# Altium schematic sheet [09] - CPU - SD, AUDIO, I2C, CAN.SchDoc
size A2; DocumentNumber: 9; SheetNumber: 9; SheetTotal: 31
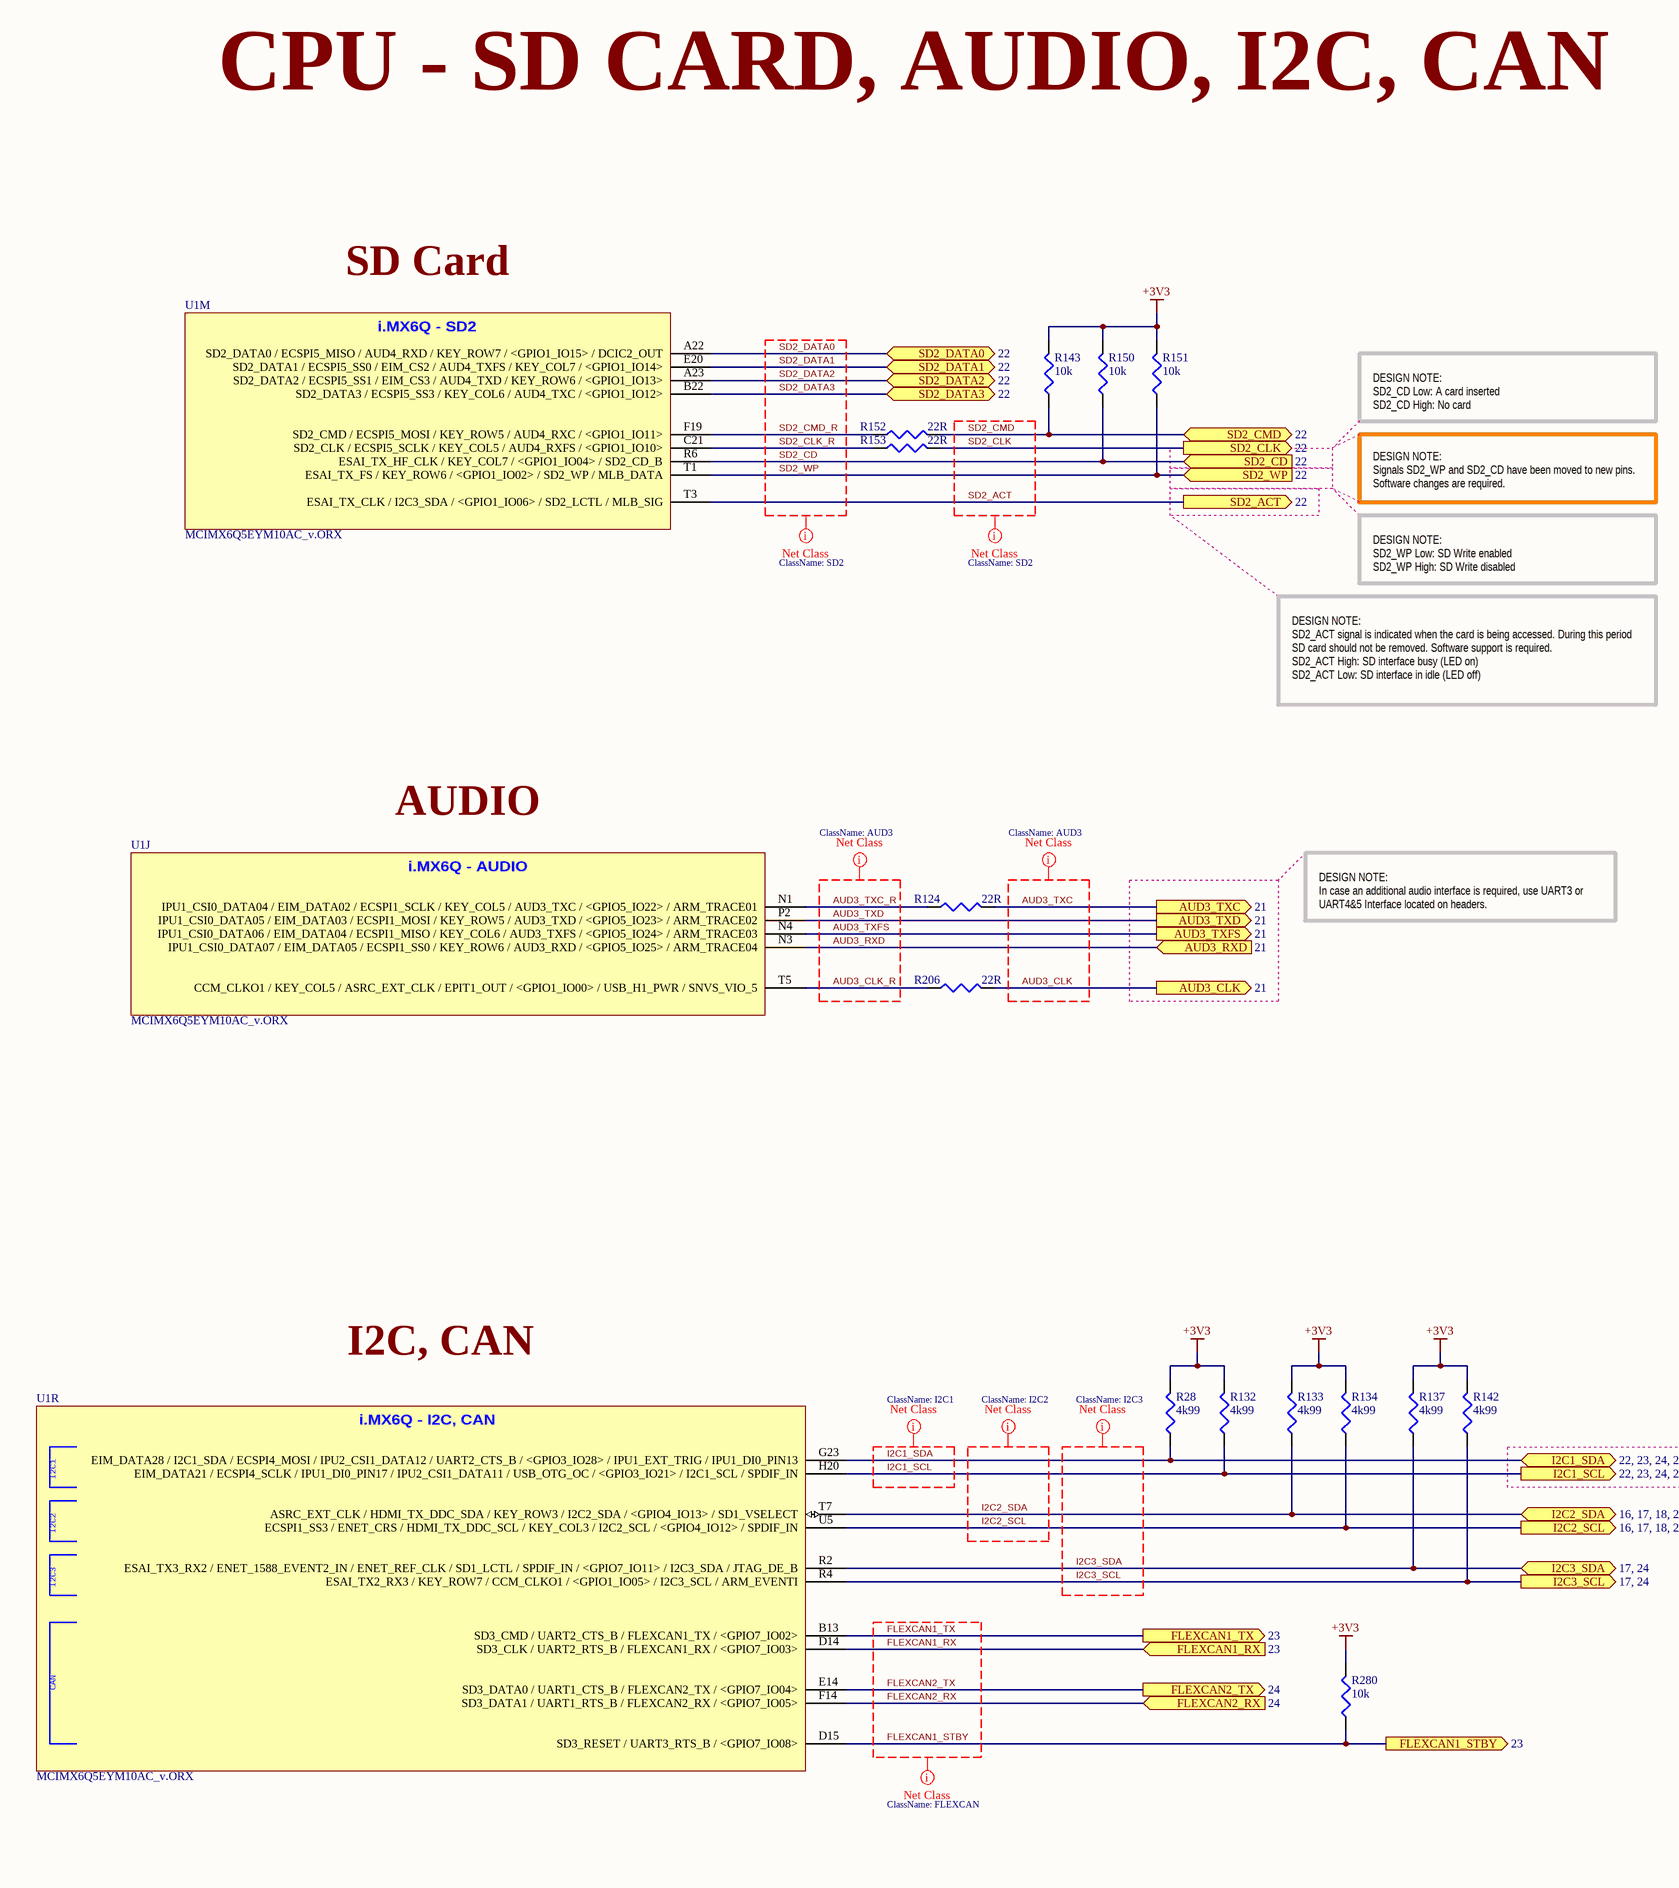
[diagram p0: [09] - CPU - SD, AUDIO, I2C, CAN.SchDoc, left]
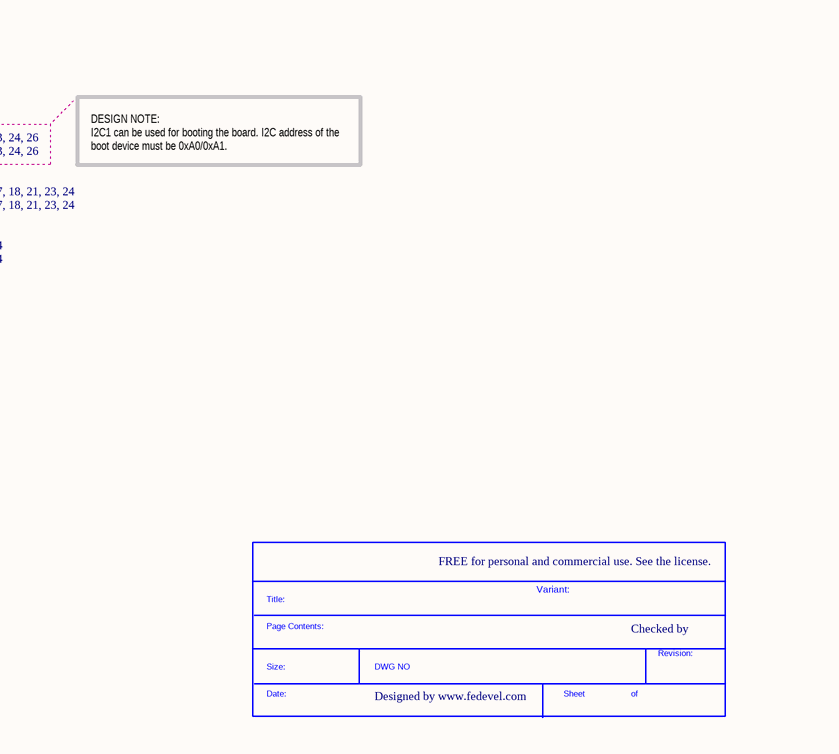
[diagram p1: [09] - CPU - SD, AUDIO, I2C, CAN.SchDoc, right]

## Parts
*  SDTitleBlock  (value not drawn)  (graphical)
R28  4k99  [R0402]
R124  22R  [R0402]
R132  4k99  [R0402]
R133  4k99  [R0402]
R134  4k99  [R0402]
R137  4k99  [R0402]
R142  4k99  [R0402]
R143  10k  [R0402]
R150  10k  [R0402]
R151  10k  [R0402]
R152  22R  [R0402]
R153  22R  [R0402]
R206  22R  [R0402]
R280  10k  [R0402]
U1  MCIMX6Q5EYM10AC_v.ORX  [PBGA624]  (parts J,M,R of 21)

## Ports
AUD3_CLK (out, see 21), AUD3_RXD (in, see 21), AUD3_TXC (out, see 21), AUD3_TXD (out, see 21), AUD3_TXFS (out, see 21), FLEXCAN1_RX (in, see 23), FLEXCAN1_STBY (out, see 23), FLEXCAN1_TX (out, see 23), FLEXCAN2_RX (in, see 24), FLEXCAN2_TX (out, see 24), I2C1_SCL (see 22, 23, 24, 26), I2C1_SDA (bidir, see 22, 23, 24, 26), I2C2_SCL (see 16, 17, 18, 21, 23, 24), I2C2_SDA (bidir, see 16, 17, 18, 21, 23, 24), I2C3_SCL (see 17, 24), I2C3_SDA (bidir, see 17, 24), SD2_ACT (out, see 22), SD2_CD (in, see 22), SD2_CLK (out, see 22), SD2_CMD (bidir, see 22), SD2_DATA0 (bidir, see 22), SD2_DATA1 (bidir, see 22), SD2_DATA2 (bidir, see 22), SD2_DATA3 (bidir, see 22), SD2_WP (in, see 22)

## Nets
+3V3: R28.2 R132.2 R133.2 R134.2 R137.2 R142.2 R143.2 R150.2 R151.2 R280.2
AUD3_CLK: R206.2 ; port AUD3_CLK
AUD3_CLK_R: R206.1 U1.T5(CCM_CLKO1_/_KEY_COL5_/_ASRC_EXT_CLK_/_EPIT1_OUT_/_<GPIO1_IO00>_/_USB_H1_PWR_/_SNVS_VIO_5)
AUD3_RXD: U1.N3(IPU1_CSI0_DATA07_/_EIM_DATA05_/_ECSPI1_SS0_/_KEY_ROW6_/_AUD3_RXD_/_<GPIO5_IO25>_/_ARM_TRACE04) ; port AUD3_RXD
AUD3_TXC: R124.2 ; port AUD3_TXC
AUD3_TXC_R: R124.1 U1.N1(IPU1_CSI0_DATA04_/_EIM_DATA02_/_ECSPI1_SCLK_/_KEY_COL5_/_AUD3_TXC_/_<GPIO5_IO22>_/_ARM_TRACE01)
AUD3_TXD: U1.P2(IPU1_CSI0_DATA05_/_EIM_DATA03_/_ECSPI1_MOSI_/_KEY_ROW5_/_AUD3_TXD_/_<GPIO5_IO23>_/_ARM_TRACE02) ; port AUD3_TXD
AUD3_TXFS: U1.N4(IPU1_CSI0_DATA06_/_EIM_DATA04_/_ECSPI1_MISO_/_KEY_COL6_/_AUD3_TXFS_/_<GPIO5_IO24>_/_ARM_TRACE03) ; port AUD3_TXFS
FLEXCAN1_RX: U1.D14(SD3_CLK_/_UART2_RTS_B_/_FLEXCAN1_RX_/_<GPIO7_IO03>) ; port FLEXCAN1_RX
FLEXCAN1_STBY: R280.1 U1.D15(SD3_RESET_/_UART3_RTS_B_/_<GPIO7_IO08>) ; port FLEXCAN1_STBY
FLEXCAN1_TX: U1.B13(SD3_CMD_/_UART2_CTS_B_/_FLEXCAN1_TX_/_<GPIO7_IO02>) ; port FLEXCAN1_TX
FLEXCAN2_RX: U1.F14(SD3_DATA1_/_UART1_RTS_B_/_FLEXCAN2_RX_/_<GPIO7_IO05>) ; port FLEXCAN2_RX
FLEXCAN2_TX: U1.E14(SD3_DATA0_/_UART1_CTS_B_/_FLEXCAN2_TX_/_<GPIO7_IO04>) ; port FLEXCAN2_TX
I2C1_SCL: R132.1 U1.H20(EIM_DATA21_/_ECSPI4_SCLK_/_IPU1_DI0_PIN17_/_IPU2_CSI1_DATA11_/_USB_OTG_OC_/_<GPIO3_IO21>_/_I2C1_SCL_/_SPDIF_IN) ; port I2C1_SCL
I2C1_SDA: R28.1 U1.G23(EIM_DATA28_/_I2C1_SDA_/_ECSPI4_MOSI_/_IPU2_CSI1_DATA12_/_UART2_CTS_B_/_<GPIO3_IO28>_/_IPU1_EXT_TRIG_/_IPU1_DI0_PIN13) ; port I2C1_SDA
I2C2_SCL: R134.1 U1.U5(ECSPI1_SS3_/_ENET_CRS_/_HDMI_TX_DDC_SCL_/_KEY_COL3_/_I2C2_SCL_/_<GPIO4_IO12>_/_SPDIF_IN) ; port I2C2_SCL
I2C2_SDA: R133.1 U1.T7(ASRC_EXT_CLK_/_HDMI_TX_DDC_SDA_/_KEY_ROW3_/_I2C2_SDA_/_<GPIO4_IO13>_/_SD1_VSELECT) ; port I2C2_SDA
I2C3_SCL: R142.1 U1.R4(ESAI_TX2_RX3_/_KEY_ROW7_/_CCM_CLKO1_/_<GPIO1_IO05>_/_I2C3_SCL_/_ARM_EVENTI) ; port I2C3_SCL
I2C3_SDA: R137.1 U1.R2(ESAI_TX3_RX2_/_ENET_1588_EVENT2_IN_/_ENET_REF_CLK_/_SD1_LCTL_/_SPDIF_IN_/_<GPIO7_IO11>_/_I2C3_SDA_/_JTAG_DE_B) ; port I2C3_SDA
SD2_ACT: U1.T3(ESAI_TX_CLK_/_I2C3_SDA_/_<GPIO1_IO06>_/_SD2_LCTL_/_MLB_SIG) ; port SD2_ACT
SD2_CD: R150.1 U1.R6(ESAI_TX_HF_CLK_/_KEY_COL7_/_<GPIO1_IO04>_/_SD2_CD_B) ; port SD2_CD
SD2_CLK: R153.2 ; port SD2_CLK
SD2_CLK_R: R153.1 U1.C21(SD2_CLK_/_ECSPI5_SCLK_/_KEY_COL5_/_AUD4_RXFS_/_<GPIO1_IO10>)
SD2_CMD: R143.1 R152.2 ; port SD2_CMD
SD2_CMD_R: R152.1 U1.F19(SD2_CMD_/_ECSPI5_MOSI_/_KEY_ROW5_/_AUD4_RXC_/_<GPIO1_IO11>)
SD2_DATA0: U1.A22(SD2_DATA0_/_ECSPI5_MISO_/_AUD4_RXD_/_KEY_ROW7_/_<GPIO1_IO15>_/_DCIC2_OUT) ; port SD2_DATA0
SD2_DATA1: U1.E20(SD2_DATA1_/_ECSPI5_SS0_/_EIM_CS2_/_AUD4_TXFS_/_KEY_COL7_/_<GPIO1_IO14>) ; port SD2_DATA1
SD2_DATA2: U1.A23(SD2_DATA2_/_ECSPI5_SS1_/_EIM_CS3_/_AUD4_TXD_/_KEY_ROW6_/_<GPIO1_IO13>) ; port SD2_DATA2
SD2_DATA3: U1.B22(SD2_DATA3_/_ECSPI5_SS3_/_KEY_COL6_/_AUD4_TXC_/_<GPIO1_IO12>) ; port SD2_DATA3
SD2_WP: R151.1 U1.T1(ESAI_TX_FS_/_KEY_ROW6_/_<GPIO1_IO02>_/_SD2_WP_/_MLB_DATA) ; port SD2_WP

## Layout directives
net class AUD3: AUD3_CLK, AUD3_CLK_R, AUD3_RXD, AUD3_TXC, AUD3_TXC_R, AUD3_TXD, AUD3_TXFS
net class FLEXCAN: FLEXCAN1_RX, FLEXCAN1_STBY, FLEXCAN1_TX, FLEXCAN2_RX, FLEXCAN2_TX
net class I2C1: I2C1_SCL, I2C1_SDA
net class I2C2: I2C2_SCL, I2C2_SDA
net class I2C3: I2C3_SCL, I2C3_SDA
net class SD2: SD2_ACT, SD2_CD, SD2_CLK, SD2_CLK_R, SD2_CMD, SD2_CMD_R, SD2_DATA0, SD2_DATA1, SD2_DATA2, SD2_DATA3, SD2_WP

## Notes on the sheet
- CPU - SD CARD, AUDIO, I2C, CAN
- SD Card
- DESIGN NOTE:
  SD2_CD Low: A card inserted
  SD2_CD High: No card
- DESIGN NOTE:
  Signals SD2_WP and SD2_CD have been moved to new pins. Software changes are required.
- DESIGN NOTE:
  SD2_WP Low: SD Write enabled
  SD2_WP High: SD Write disabled
- DESIGN NOTE:
  SD2_ACT signal is indicated when the card is being accessed. During this period SD card should not be removed. Software support is required.
  SD2_ACT High: SD interface busy (LED on)
  SD2_ACT Low: SD interface in idle (LED off)
- AUDIO
- DESIGN NOTE:
  In case an additional audio interface is required, use UART3 or UART4&5 Interface located on headers.
- I2C, CAN
- DESIGN NOTE:
  I2C1 can be used for booting the board. I2C address of the boot device must be 0xA0/0xA1.
- FREE for personal and commercial use. See the license.
- Variant:
- Checked by
- Designed by www.fedevel.com
- (in symbol MCIMX6Q5EYM10AC_v.ORX, part J) i.MX6Q - AUDIO
- (in symbol MCIMX6Q5EYM10AC_v.ORX, part M) i.MX6Q - SD2
- (in symbol MCIMX6Q5EYM10AC_v.ORX, part R) i.MX6Q - I2C, CAN; I2C1; I2C2; I2C3; CAN
- (in symbol SDTitleBlock) Title:; Page Contents:; Revision:; Size:; DWG NO; Date:; Sheet; of

## Library data of the parts
R28 R132-R134 R137 R142 = RMCF0402FT4K99: RES TF 4.99K OHM 1% 1/16W 0402; Manufacturer: Stackpole Electronics Inc; Power (Watts): 0.063W, 1/16W; .Checked PCB: used; Temperature Coefficient: ±100ppm/°C; Category: Resistors; Supplier Part Number: RMCF0402FT4K99CT-ND; Manufacturer Part Number: RMCF0402FT4K99; Package / Case: 0402 (1005 Metric); Price 1k [$]: 0.00384; Resistance (Ohms): 4.99K; Tolerance: ±1%; Value: 4k99; .Checked SCH: used; Supplier: Digikey; Supplier 1: Digi-Key; Supplier Part Number 1: RMCF0402FT4K99CT-ND; RoHS: RoHS Compliant; Stock 1: 48509; Pricing 1: 1=0.04, 10=0.025, 50=0.0138, 100=0.0105, 250=0.0078, 500=0.00576, 1000=0.00384 (USD); Composition: Thick Film; Features: -; Size / Dimension: 0.039" L x 0.020" W (1.00mm x 0.50mm); Height: 0.016" (0.40mm); Number of Terminations: 2; Packaging: Cut Tape (CT); ComponentLink1URL: http://www.seielect.com/Catalog/SEI-RMCF.pdf; ComponentLink1Description: http://www.seielect.com/Catalog/SEI-RMCF.pdf
R124 R152 R153 R206 = RC0402FR-0722RL: RES 22.0 OHM 1/16W 1% 0402 SMD; Manufacturer: Yageo; Resistance (Ohms): 22; Power (Watts): 0.063W, 1/16W; .Checked PCB: used; Temperature Coefficient: ±100ppm/°C; Category: Resistors; Supplier Part Number: 311-22.0LRCT-ND; Manufacturer Part Number: RC0402FR-0722RL; Package / Case: 0402 (1005 Metric); Price 1k [$]: 0.01421; Tolerance: ±1%; Value: 22R; .Checked SCH: used; Supplier: Digikey; Supplier 1: Digi-Key; Supplier Part Number 1: 311-22.0LRCT-ND; RoHS: RoHS Compliant; Stock 1: 943800; Pricing 1: 10=0.014, 50=0.0104, 100=0.0079, 250=0.00584, 500=0.00432, 1000=0.00288 (USD); Composition: Thick Film; Features: -; Size / Dimension: 0.039" L x 0.020" W (1.00mm x 0.50mm); Height: 0.016" (0.40mm); Number of Terminations: 2; Packaging: Cut Tape (CT); ComponentLink1URL: http://www.yageo.com/documents/recent/PYu-RC0402_51_RoHS_L_6.pdf; ComponentLink1Description: http://www.yageo.com/documents/recent/PYu-RC0402_51_RoHS_L_6.pdf
R143 R150 R151 R280 = RC0402FR-0710KL: RES 10.0K OHM 1/16W 1% 0402 SMD; Manufacturer: Yageo; Power (Watts): 0.063W, 1/16W; .Checked PCB: used; Temperature Coefficient: ±100ppm/°C; Category: Resistors; Supplier Part Number: 311-10.0KLRCT-ND; Manufacturer Part Number: RC0402FR-0710KL; Package / Case: 0402 (1005 Metric); Price 1k [$]: 0.01421; Resistance (Ohms): 10K; Tolerance: ±1%; Value: 10k; .Checked SCH: used; Supplier: Digikey; Supplier 1: Digi-Key; Supplier Part Number 1: 311-10.0KLRCT-ND; RoHS: RoHS Compliant; Stock 1: 2916495; Pricing 1: 10=0.014, 50=0.0104, 100=0.0079, 250=0.00584, 500=0.00432, 1000=0.00288 (USD); Composition: Thick Film; Features: -; Size / Dimension: 0.039" L x 0.020" W (1.00mm x 0.50mm); Height: 0.016" (0.40mm); Number of Terminations: 2; Packaging: Cut Tape (CT); ComponentLink1URL: http://www.yageo.com/documents/recent/PYu-RC0402_51_RoHS_L_6.pdf; ComponentLink1Description: http://www.yageo.com/documents/recent/PYu-RC0402_51_RoHS_L_6.pdf
U1 = MCIMX6Q5EYM10AC_v.ORX: IC MCU 32BIT ARM QUAD 624FCBGA; Manufacturer: Freescale Semiconductor; Core Processor: ARM® Cortex™-A9; Core Size: 32-Bit Quad-Core; Speed: 1.0GHz; Connectivity: CAN, EBI/EMI, ESAI, Ethernet, GPMI, I2C, MMC/SD, PCI, SATA, SPI, UART, USB, USB OTG; Peripherals: DMA, HDMI, I2S/SSI/AC97, MIPI CSI, MIMI DSI, MIPI HIS, PWM, WDT; Number of I /O: 224; Program Memory Type: External Program Memory; RAM Size: 256K x 8; Voltage - Supply (Vcc/Vdd): 0.925 V ~ 1.5 V; Oscillator Type: Internal; .Creator: MM; .Checked PCB: MM, checked by RF; Supplier 1: Digi-Key; Manufacturer Part Number: MCIMX6Q5EYM10AC; RoHS: RoHS Compliant; Category: Integrated Circuits (ICs); Stock 1: 0; Pricing 1: 1=54.98, 10=51.922, 25=48.868, 100=30.5424 (USD); Program Memory Size: -; EEPROM Size: -; Data Converters: -; Operating Temperature: -20°C ~ 105°C; Package / Case: 624-FBGA, FCBGA; Packaging: Tray; ComponentLink1URL: http://cache.freescale.com/files/32bit/doc/data_sheet/IMX6DQCEC.pdf; ComponentLink1Description: http://cache.freescale.com/files/32bit/doc/data_sheet/IMX6DQCEC.pdf; Supplier Part Number 1: MCIMX6Q5EYM10AC-ND